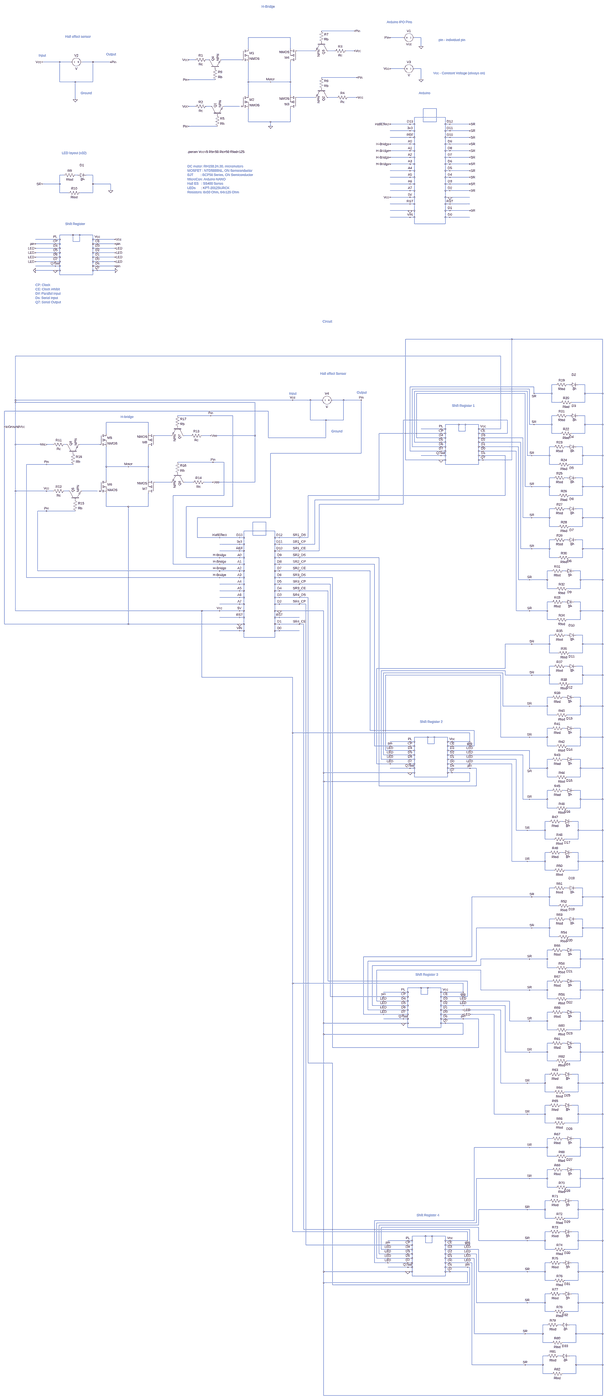
[diagram p0: schematic PoVD_PCB1.asc, whole sheet]
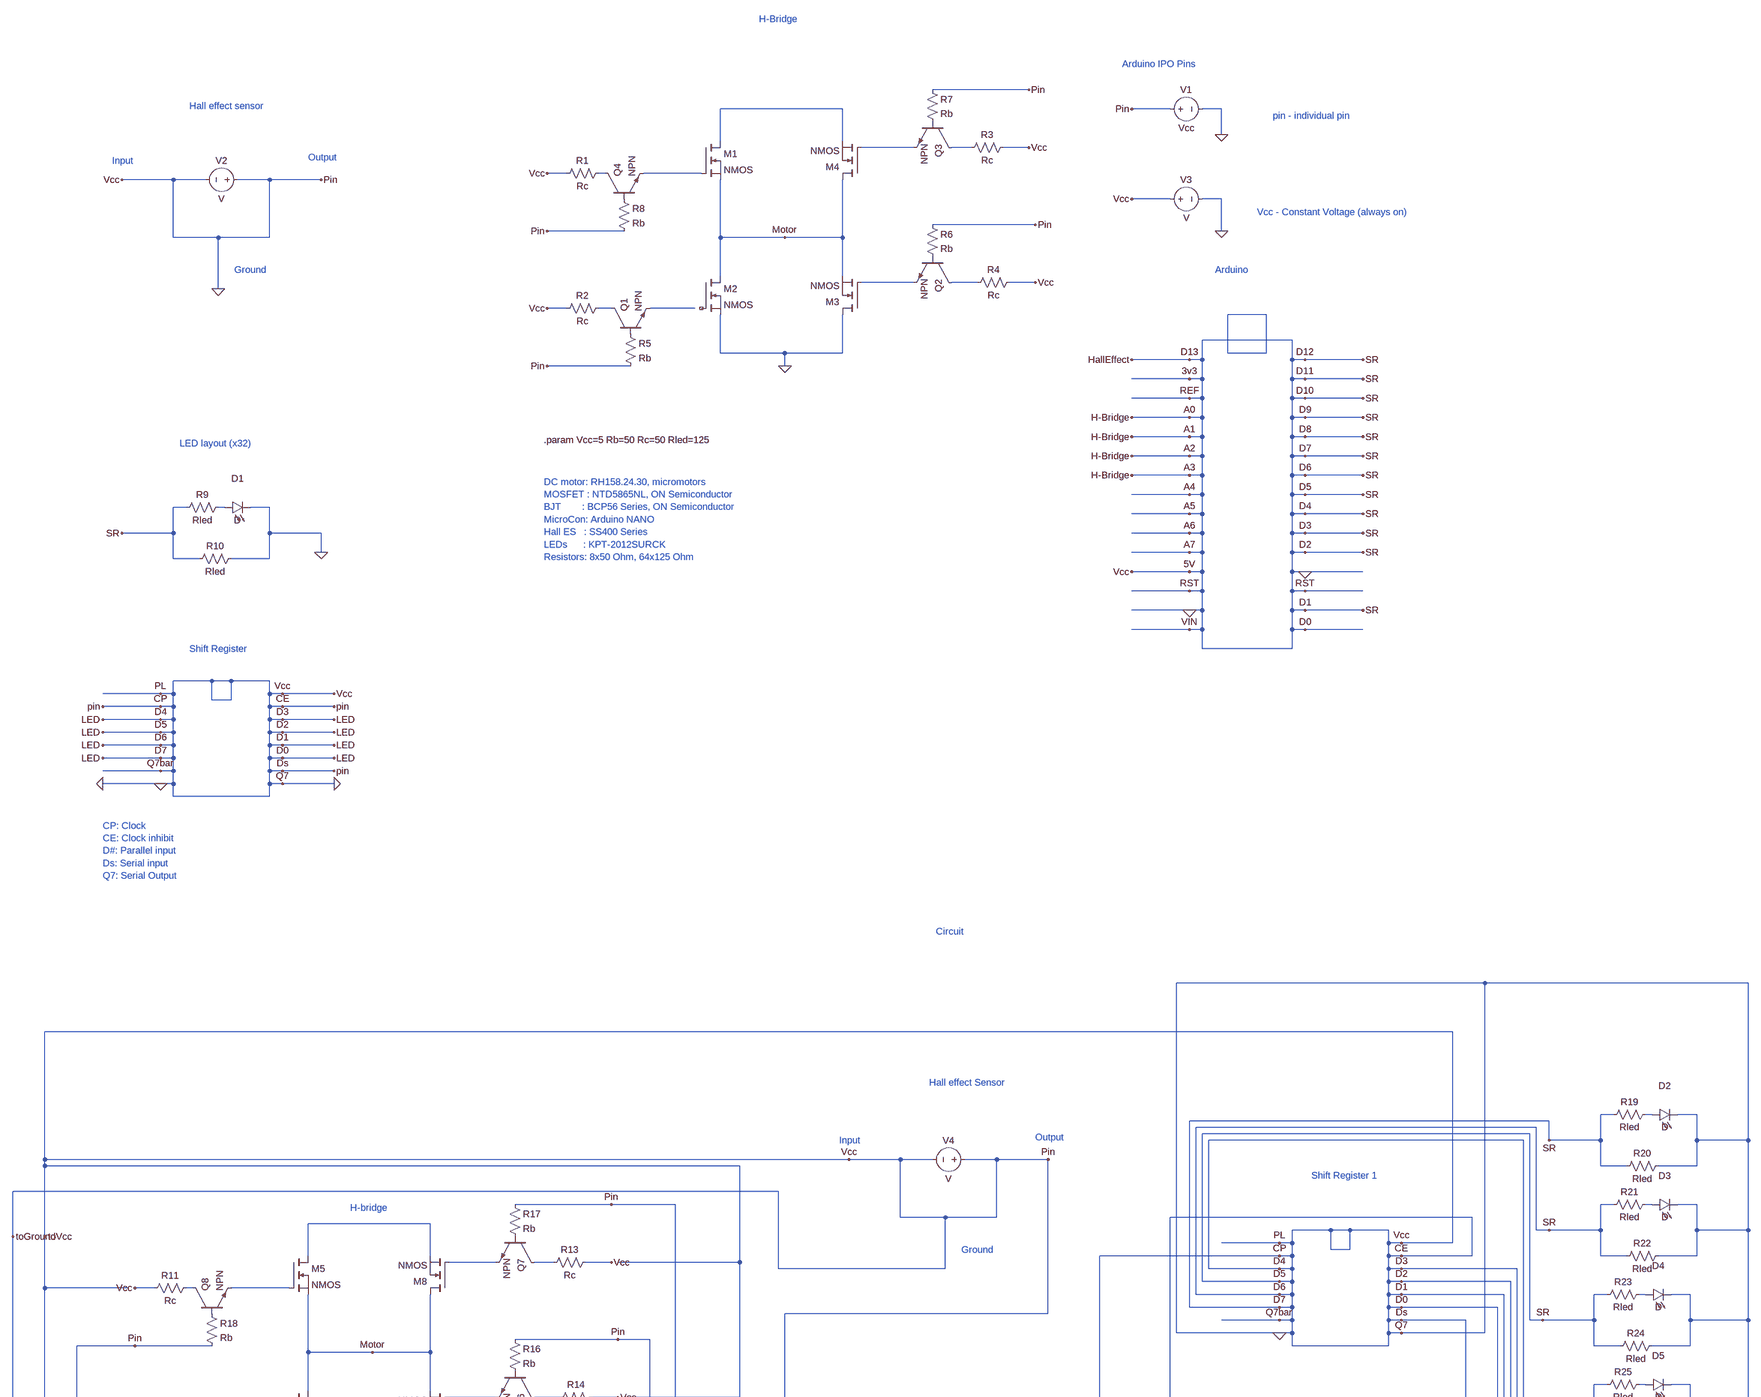
[diagram p1: schematic PoVD_PCB1.asc, part, row 1 of 3, column 1 of 1]
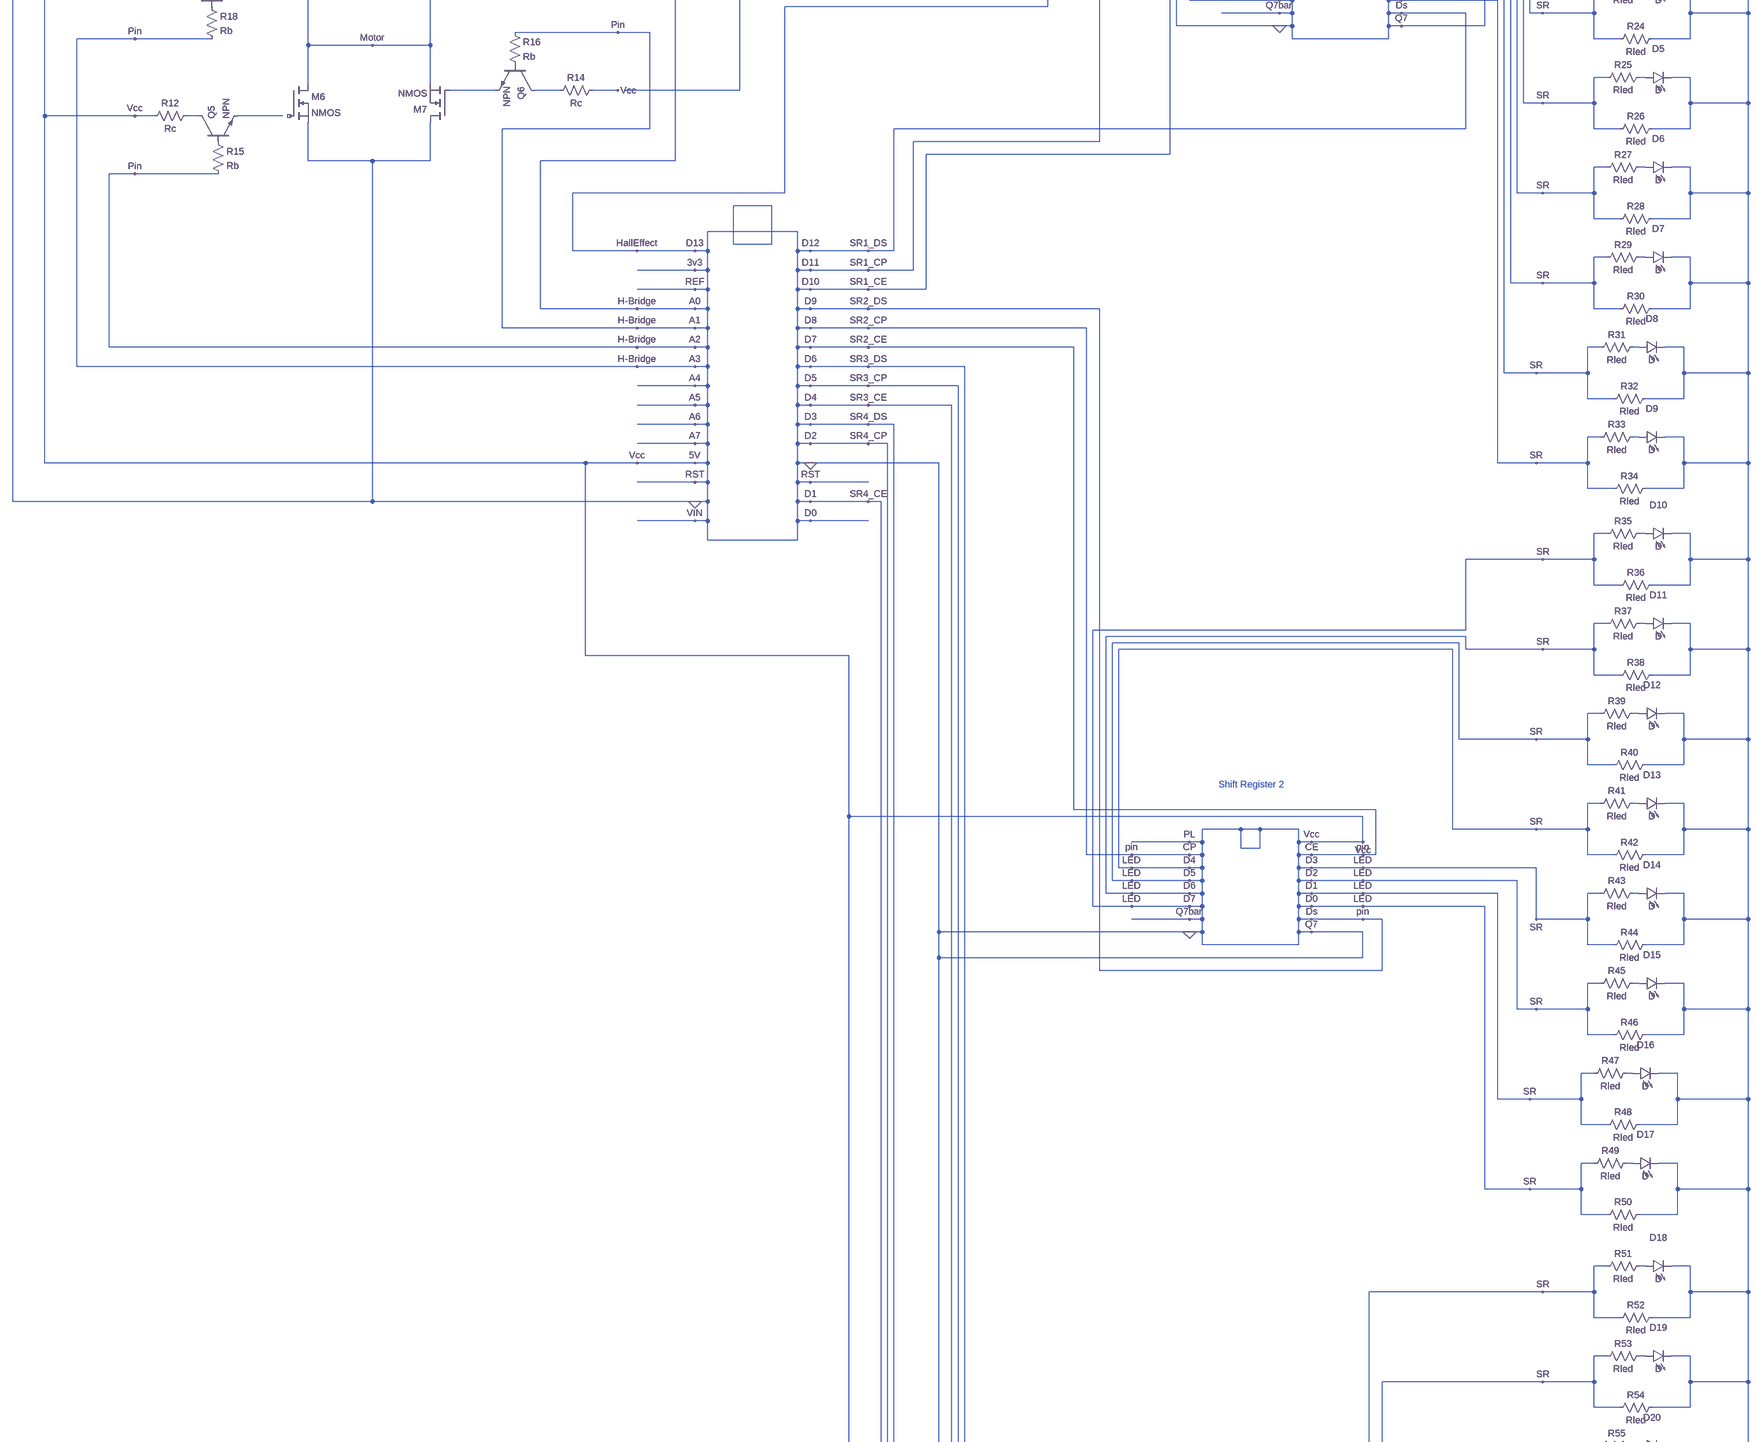
[diagram p2: schematic PoVD_PCB1.asc, part, row 2 of 3, column 1 of 1]
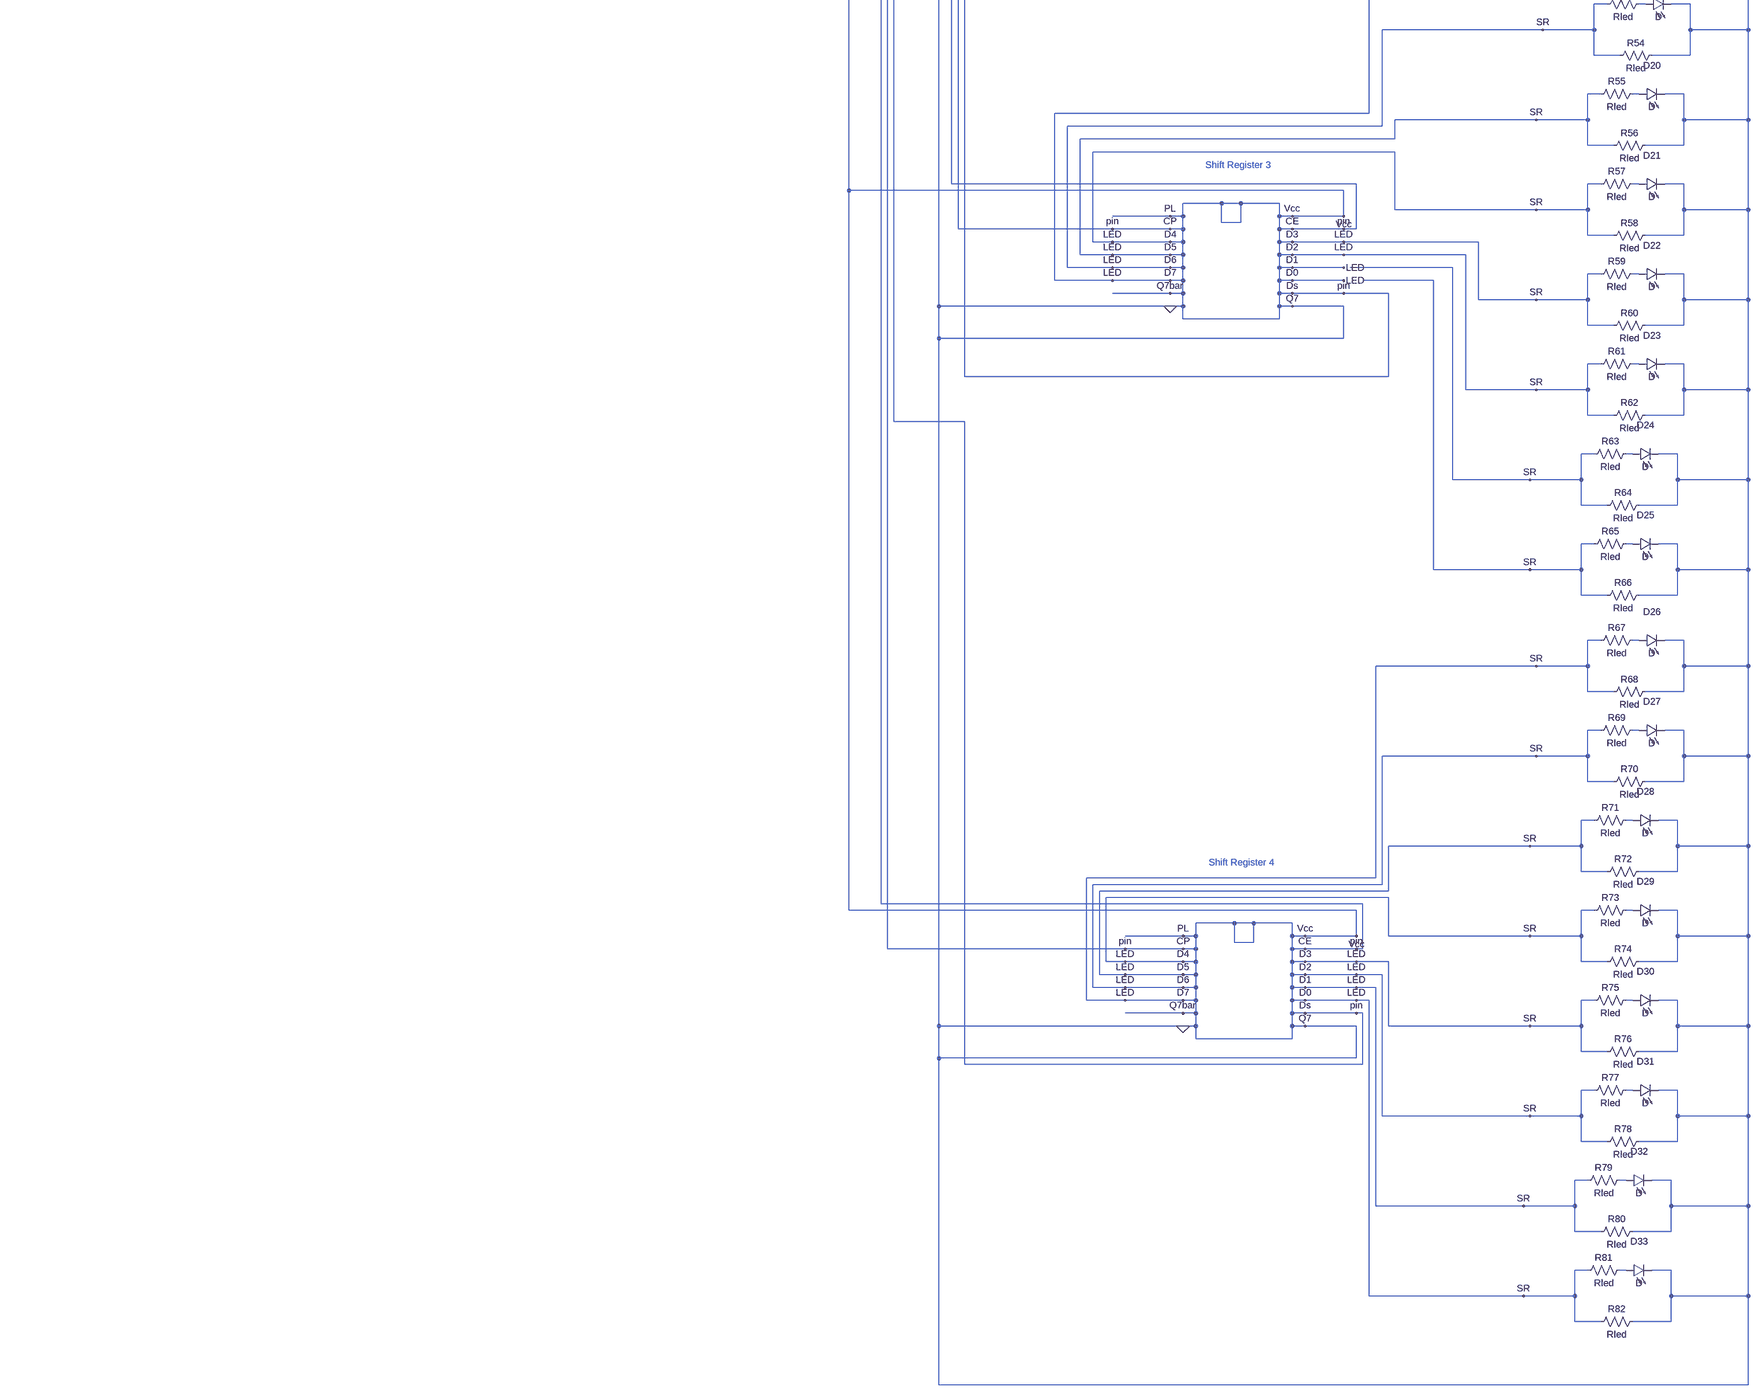
[diagram p3: schematic PoVD_PCB1.asc, part, row 3 of 3, column 1 of 1]
* PoVD_PCB1.asc
M1 N001 N005 Motor Motor NMOS
M2 Motor NC_01 0 0 NMOS
M3 0 N006 Motor Motor NMOS
M4 Motor N002 N001 N001 NMOS
Q1 N008 P001 N009 0 NPN
Q2 N007 P002 N006 0 NPN
Q3 N003 P003 N002 0 NPN
Q4 N004 P004 N005 0 NPN
R1 N004 0 Rc
R2 N008 0 Rc
R3 0 N003 Rc
R4 0 N007 Rc
R5 P001 0 Rb
R6 0 P002 Rb
R7 0 P003 Rb
R8 P004 0 Rb
V1 0 0 Vcc
V2 0 0 V
V3 0 0 V
D1 N011 0 D
R9 N011 0 Rled
R10 0 0 Rled
M5 N014 N018 Motor Motor NMOS
M6 Motor NC_02 0 0 NMOS
M7 0 N021 Motor Motor NMOS
M8 Motor N015 N014 N014 NMOS
Q5 N023 P005 N024 0 NPN
Q6 N022 P006 N021 0 NPN
Q7 N016 P007 N015 0 NPN
Q8 N017 P008 N018 0 NPN
R11 N017 0 Rc
R12 N023 0 Rc
R13 0 N016 Rc
R14 0 N022 Rc
R15 P005 0 Rb
R16 0 P006 Rb
R17 0 P007 Rb
R18 P008 0 Rb
V4 0 0 V
D2 N012 0 D
R19 N012 0 Rled
R20 0 0 Rled
D3 N013 0 D
R21 N013 0 Rled
R22 0 0 Rled
D4 N019 0 D
R23 N019 0 Rled
R24 0 0 Rled
D5 N020 0 D
R25 N020 0 Rled
R26 0 0 Rled
D6 N025 0 D
R27 N025 0 Rled
R28 0 0 Rled
D7 N027 0 D
R29 N027 0 Rled
R30 0 0 Rled
D8 N028 0 D
R31 N028 0 Rled
R32 0 0 Rled
D9 N029 0 D
R33 N029 0 Rled
R34 0 0 Rled
D10 N030 0 D
R35 N030 0 Rled
R36 0 0 Rled
D11 N031 0 D
R37 N031 0 Rled
R38 0 0 Rled
D12 N032 0 D
R39 N032 0 Rled
R40 0 0 Rled
D13 N033 0 D
R41 N033 0 Rled
R42 0 0 Rled
D14 N034 0 D
R43 N034 0 Rled
R44 0 0 Rled
D15 N035 0 D
R45 N035 0 Rled
R46 0 0 Rled
D16 N036 0 D
R47 N036 0 Rled
R48 0 0 Rled
D17 N037 0 D
R49 N037 0 Rled
R50 0 0 Rled
D18 N038 0 D
R51 N038 0 Rled
R52 0 0 Rled
D19 N039 0 D
R53 N039 0 Rled
R54 0 0 Rled
D20 N040 0 D
R55 N040 0 Rled
R56 0 0 Rled
D21 N041 0 D
R57 N041 0 Rled
R58 0 0 Rled
D22 N042 0 D
R59 N042 0 Rled
R60 0 0 Rled
D23 N043 0 D
R61 N043 0 Rled
R62 0 0 Rled
D24 N044 0 D
R63 N044 0 Rled
R64 0 0 Rled
D25 N045 0 D
R65 N045 0 Rled
R66 0 0 Rled
D26 N046 0 D
R67 N046 0 Rled
R68 0 0 Rled
D27 N047 0 D
R69 N047 0 Rled
R70 0 0 Rled
D28 N048 0 D
R71 N048 0 Rled
R72 0 0 Rled
D29 N049 0 D
R73 N049 0 Rled
R74 0 0 Rled
D30 N050 0 D
R75 N050 0 Rled
R76 0 0 Rled
D31 N051 0 D
R77 N051 0 Rled
R78 0 0 Rled
D32 N052 0 D
R79 N052 0 Rled
R80 0 0 Rled
D33 N053 0 D
R81 N053 0 Rled
R82 0 0 Rled
.model D D
.lib standard.dio
.model NPN NPN
.model PNP PNP
.lib standard.bjt
.model NMOS NMOS
.model PMOS PMOS
.lib standard.mos
.param Vcc=5 Rb=50 Rc=50 Rled=125
* Arduino IPO Pins
* Hall effect sensor
* Input
* Output
* Ground
* pin - individual pin
* Vcc - Constant Voltage (always on)
* DC motor: RH158.24.30, micromotors
* MOSFET : NTD5865NL, ON Semiconductor
* BJT        : BCP56 Series, ON Semiconductor
* MicroCon: Arduino NANO
* Hall ES   : SS400 Series
* LEDs      : KPT-2012SURCK
* Resistors: 8x50 Ohm, 64x125 Ohm
* LED layout (x32)
* H-Bridge
* Arduino
* Shift Register
* CP: Clock
* CE: Clock inhibit
* D#: Parallel input
* Ds: Serial input
* Q7: Serial Output
* Circuit
* Input
* Output
* Ground
* H-bridge
* Hall effect Sensor
* Shift Register 1
* Shift Register 2
* Shift Register 3
* Shift Register 4
.backanno
.end